# EAGLE schematic M7010X (EAGLE 6.6.0)
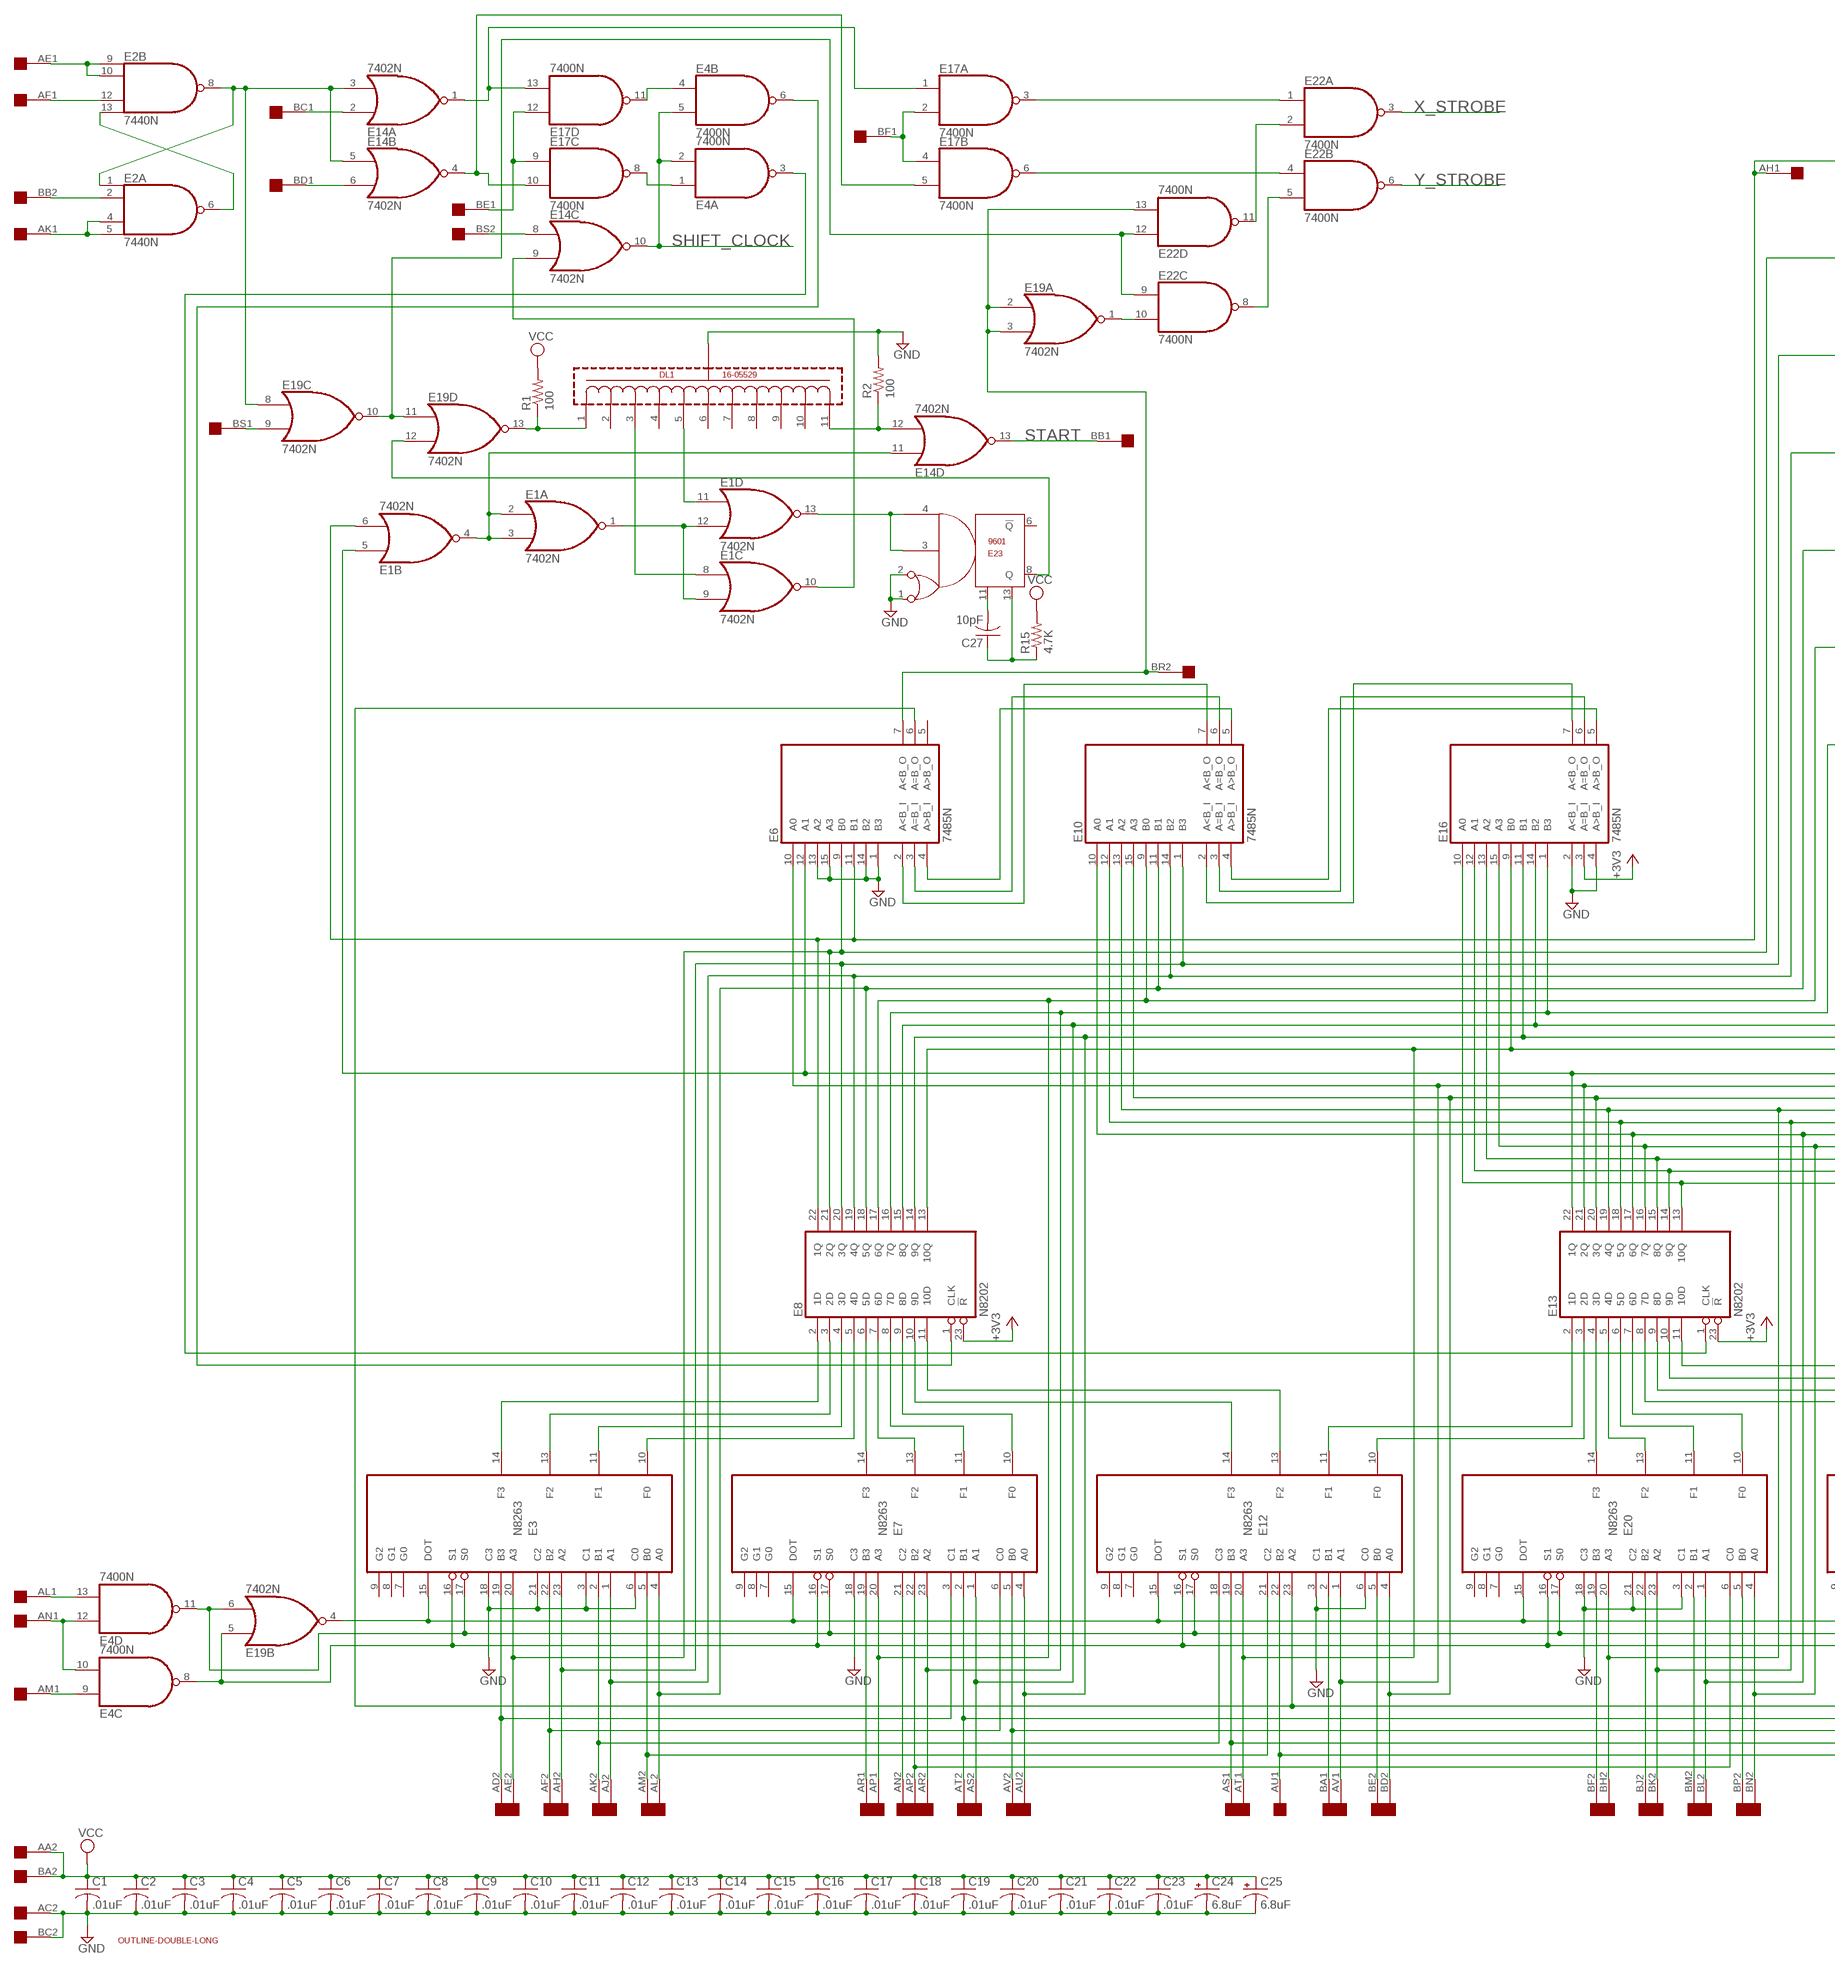
[diagram p0: schematic, sheet 1, part 1 of 2]
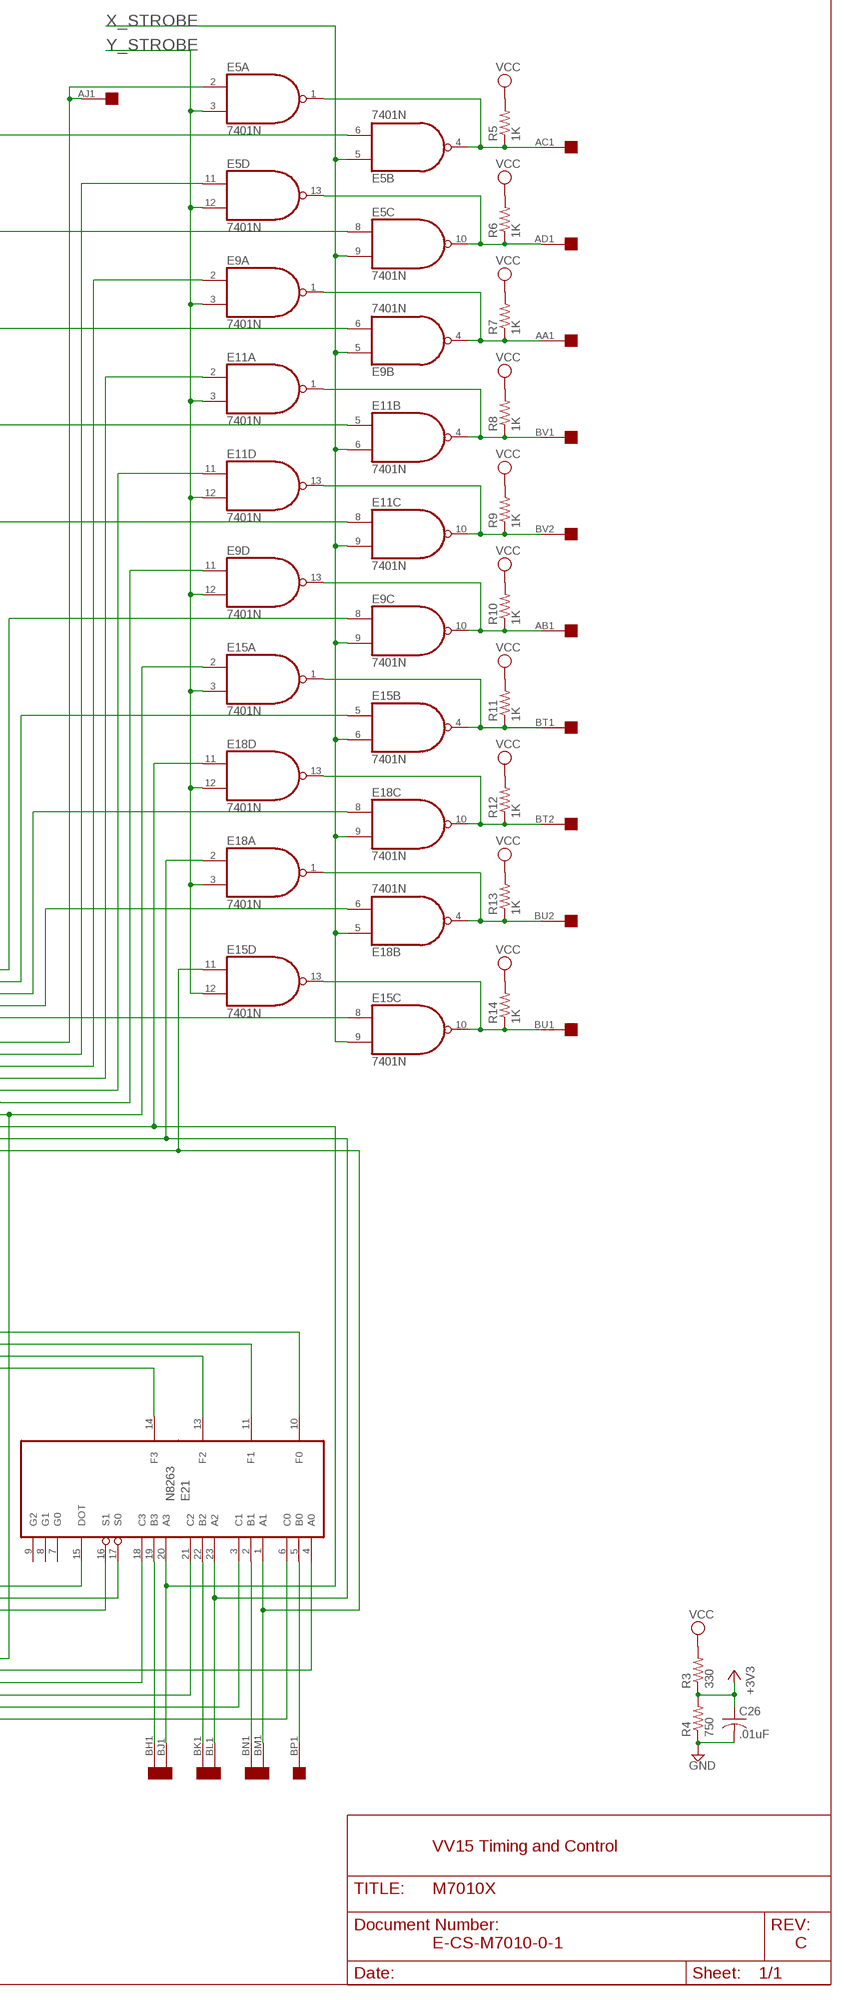
[diagram p1: schematic, sheet 1, part 2 of 2]

## Parts
C1  .01uF  C-US050-025X075  [C050-025X075]
C2  .01uF  C-US050-025X075  [C050-025X075]
C3  .01uF  C-US050-025X075  [C050-025X075]
C4  .01uF  C-US050-025X075  [C050-025X075]
C5  .01uF  C-US050-025X075  [C050-025X075]
C6  .01uF  C-US050-025X075  [C050-025X075]
C7  .01uF  C-US050-025X075  [C050-025X075]
C8  .01uF  C-US050-025X075  [C050-025X075]
C9  .01uF  C-US050-025X075  [C050-025X075]
C10  .01uF  C-US050-025X075  [C050-025X075]
C11  .01uF  C-US050-025X075  [C050-025X075]
C12  .01uF  C-US050-025X075  [C050-025X075]
C13  .01uF  C-US050-025X075  [C050-025X075]
C14  .01uF  C-US050-025X075  [C050-025X075]
C15  .01uF  C-US050-025X075  [C050-025X075]
C16  .01uF  C-US050-025X075  [C050-025X075]
C17  .01uF  C-US050-025X075  [C050-025X075]
C18  .01uF  C-US050-025X075  [C050-025X075]
C19  .01uF  C-US050-025X075  [C050-025X075]
C20  .01uF  C-US050-025X075  [C050-025X075]
C21  .01uF  C-US050-025X075  [C050-025X075]
C22  .01uF  C-US050-025X075  [C050-025X075]
C23  .01uF  C-US050-025X075  [C050-025X075]
C24  6.8uF  CPOL-USE20-8AXIAL  [E12-8]
C25  6.8uF  CPOL-USE20-8AXIAL  [E12-8]
C26  .01uF  C-US050-025X075  [C050-025X075]
C27  10pF  C-US050-025X075  [C050-025X075]
DL1  16-05529  [16-05529]
E1  7402N  [DIL14]
E2  7440N  7420N  [DIL14]
E3  N8263  [DIL24]
E4  7400N  [DIL14]
E5  7401N  74LS01N  [DIL14]
E6  7485N  [DIL16]
E7  N8263  [DIL24]
E8  N8202  [DIL24]
E9  7401N  74LS01N  [DIL14]
E10  7485N  [DIL16]
E11  7401N  74LS01N  [DIL14]
E12  N8263  [DIL24]
E13  N8202  [DIL24]
E14  7402N  [DIL14]
E15  7401N  74LS01N  [DIL14]
E16  7485N  [DIL16]
E17  7400N  [DIL14]
E18  7401N  74LS01N  [DIL14]
E19  7402N  [DIL14]
E20  N8263  [DIL24]
E21  N8263  [DIL24]
E22  7400N  [DIL14]
E23  9601  [DIL14]
R1  100  R-US_0207/10  [0207/10]
R2  100  R-US_0207/10  [0207/10]
R3  330  R-US_0207/10  [0207/10]
R4  750  R-US_0207/10  [0207/10]
R5  1K  R-US_0207/10  [0207/10]
R6  1K  R-US_0207/10  [0207/10]
R7  1K  R-US_0207/10  [0207/10]
R8  1K  R-US_0207/10  [0207/10]
R9  1K  R-US_0207/10  [0207/10]
R10  1K  R-US_0207/10  [0207/10]
R11  1K  R-US_0207/10  [0207/10]
R12  1K  R-US_0207/10  [0207/10]
R13  1K  R-US_0207/10  [0207/10]
R14  1K  R-US_0207/10  [0207/10]
R15  4.7K  R-US_0207/10  [0207/10]
U$1  OUTLINE-DOUBLE-LONG  [DOUBLE-LONG]
U$3  DOUBLE  [EDGE-CON4]

## Nets
+3V3: C26.1 E8.23(!R) E13.23(!R) E16.3(A=B_I) R3.1 R4.2
GND [supply]: C1.2 C2.2 C3.2 C4.2 C5.2 C6.2 C7.2 C8.2 C9.2 C10.2 C11.2 C12.2 C13.2 C14.2 C15.2 C16.2 C17.2 C18.2 C19.2 C20.2 C21.2 C22.2 C23.2 C24.- C25.- C26.2 DL1.12(GND) E3.3(C1) E3.6(C0) E3.18(C3) E3.21(C2) E6.1(B3) E6.13(A2) E6.14(B2) E6.15(A3) E7.18(C3) E12.3(C1) E12.6(C0) E16.2(A<B_I) E16.4(A>B_I) E20.3(C1) E20.18(C3) E20.21(C2) E23.1 E23.2 R2.2 R4.1 U$3.AC2 U$3.BC2
N$1: E3.20(A3) E5.8(C:I0) E6.9(B0) E8.21(2Q) U$3.AE2
N$2: E3.23(A2) E8.20(3Q) E9.6(B:I1) E10.1(B3) U$3.AH2
N$3: E3.1(A1) E8.19(4Q) E10.14(B2) E11.5(B:I0) U$3.AJ2
N$4: E3.4(A0) E8.18(5Q) E10.11(B1) E11.8(C:I0) U$3.AL2
N$5: E3.19(B3) E7.3(C1) U$3.AD2
N$6: E3.22(B2) E7.6(C0) U$3.AF2
N$7: E3.2(B1) E12.18(C3) U$3.AK2
N$8: E3.5(B0) E12.21(C2) U$3.AM2
N$9: E7.21(C2) U$3.AN2
N$10: E3.15(DOT) E7.15(DOT) E12.15(DOT) E19.4(B:O) E20.15(DOT) E21.15(DOT)
N$11: E3.17(S0) E4.11(D:O) E7.17(S0) E12.17(S0) E19.6(B:I1) E20.17(S0) E21.17(S0)
N$12: E3.16(S1) E4.8(C:O) E7.16(S1) E12.16(S1) E19.5(B:I0) E20.16(S1) E21.16(S1)
N$13: E7.5(B0) E21.21(C2) U$3.AV2
N$14: E7.2(B1) E21.18(C3) U$3.AT2
N$15: E7.22(B2) E20.6(C0) U$3.AP2
N$16: E7.20(A3) E8.17(6Q) E9.8(C:I0) E10.9(B0) U$3.AP1
N$17: E1.10(C:O) E14.9(C:I1)
N$18: E7.1(A1) E8.15(8Q) E16.14(B2) E18.8(C:I0) U$3.AS2
N$19: E7.23(A2) E8.16(7Q) E15.5(B:I0) E16.1(B3) U$3.AR2
N$20: E7.19(B3) U$3.AR1
N$21: E7.14(F3) E8.6(5D)
N$22: E7.13(F2) E8.7(6D)
N$23: E7.11(F1) E8.8(7D)
N$24: E7.10(F0) E8.9(8D)
N$25: E3.10(F0) E8.5(4D)
N$26: E3.11(F1) E8.4(3D)
N$27: E3.13(F2) E8.3(2D)
N$28: E3.14(F3) E8.2(1D)
N$29: E8.10(9D) E12.14(F3)
N$30: E8.11(10D) E12.13(F2)
N$31: E13.4(3D) E20.14(F3)
N$32: E13.5(4D) E20.13(F2)
N$33: E13.6(5D) E20.11(F1)
N$34: E13.7(6D) E20.10(F0)
N$35: E12.10(F0) E13.3(2D)
N$36: E12.11(F1) E13.2(1D)
N$37: E13.10(9D) E21.11(F1)
N$38: E13.8(7D) E21.14(F3)
N$39: E13.9(8D) E21.13(F2)
N$40: E13.11(10D) E21.10(F0)
N$41: E5.1(A:O) E5.4(B:O) R5.1 U$3.AC1
N$42: E5.10(C:O) E5.13(D:O) R6.1 U$3.AD1
N$43: E15.10(C:O) E15.13(D:O) R14.1 U$3.BU1
N$44: E18.1(A:O) E18.4(B:O) R13.1 U$3.BU2
N$45: E18.10(C:O) E18.13(D:O) R12.1 U$3.BT2
N$46: E15.1(A:O) E15.4(B:O) R11.1 U$3.BT1
N$47: E9.10(C:O) E9.13(D:O) R10.1 U$3.AB1
N$48: E9.1(A:O) E9.4(B:O) R7.1 U$3.AA1
N$49: E11.1(A:O) E11.4(B:O) R8.1 U$3.BV1
N$50: E11.10(C:O) E11.13(D:O) R9.1 U$3.BV2
N$51: E1.2(A:I0) E1.3(A:I1) E1.4(B:O) E14.11(D:I0)
N$52: DL1.11 E14.12(D:I1) R2.1
N$53: E2.1(A:I0) E2.8(B:O) E14.3(A:I1) E14.5(B:I0) E19.8(C:I0)
N$54: E1.5(B:I0) E5.2(A:I0) E6.12(A1) E13.22(1Q) U$3.AJ1
N$55: E1.6(B:I1) E5.6(B:I1) E6.11(B1) E8.22(1Q) U$3.AH1
N$56: E5.11(D:I0) E6.10(A0) E12.1(A1) E13.21(2Q) U$3.AV1
N$58: E9.2(A:I0) E10.15(A3) E12.4(A0) E13.20(3Q) U$3.BD2
N$60: E10.13(A2) E11.2(A:I0) E13.19(4Q) E20.20(A3) U$3.BH2
N$62: E10.12(A1) E11.11(D:I0) E13.18(5Q) E20.23(A2) U$3.BK2
N$63: E19.9(C:I1) U$3.BS1
N$64: E9.11(D:I0) E10.10(A0) E13.17(6Q) E20.1(A1) U$3.BL2
N$65: E8.13(10Q) E12.20(A3) E15.8(C:I0) E16.9(B0) U$3.AT1
N$66: E13.13(10Q) E15.11(D:I0) E16.10(A0) E21.1(A1) U$3.BM1
N$67: E7.4(A0) E8.14(9Q) E16.11(B1) E18.6(B:I1) U$3.AU2
N$68: E13.14(9Q) E16.12(A1) E18.2(A:I0) E21.23(A2) U$3.BL1
N$70: E13.15(8Q) E16.13(A2) E18.11(D:I0) E21.20(A3) U$3.BJ1
N$72: E13.16(7Q) E15.2(A:I0) E16.15(A3) E20.4(A0) U$3.BN2
N$73: E6.6(A=B_O) E12.23(A2) E21.4(A0)
N$74: E12.19(B3) E21.3(C1) U$3.AS1
N$76: E12.22(B2) E21.6(C0) U$3.AU1
N$77: E4.13(D:I1) U$3.AL1
N$78: E12.2(B1) U$3.BA1
N$80: E12.5(B0) U$3.BE2
N$82: E20.19(B3) U$3.BF2
N$84: E20.22(B2) U$3.BJ2
N$86: E20.2(B1) U$3.BM2
N$88: E20.5(B0) U$3.BP2
N$90: E21.19(B3) U$3.BH1
N$92: E21.22(B2) U$3.BK1
N$95: E21.2(B1) U$3.BN1
N$96: E21.5(B0) U$3.BP1
N$97: E4.9(C:I0) U$3.AM1
N$98: E10.4(A>B_I) E16.5(A>B_O)
N$99: E10.3(A=B_I) E16.6(A=B_O)
N$100: E10.2(A<B_I) E16.7(A<B_O)
N$101: E6.4(A>B_I) E10.5(A>B_O)
N$102: E6.3(A=B_I) E10.6(A=B_O)
N$103: E6.2(A<B_I) E10.7(A<B_O)
N$104: E4.10(C:I1) E4.12(D:I0) U$3.AN1
N$105: E14.6(B:I1) U$3.BD1
N$106: E14.2(A:I0) U$3.BC1
N$107: E14.4(B:O) E17.5(B:I1) E17.10(C:I1)
N$108: E2.9(B:I0) E2.10(B:I1) U$3.AE1
N$109: E2.12(B:I2) U$3.AF1
N$110: E2.6(A:O) E2.13(B:I3)
N$112: E2.2(A:I1) U$3.BB2
N$113: E2.4(A:I2) E2.5(A:I3) U$3.AK1
N$114: E14.1(A:O) E17.1(A:I0) E17.13(D:I1)
N$115: E17.9(C:I0) E17.12(D:I0) U$3.BE1
N$116: E4.1(A:I0) E17.8(C:O)
N$117: E4.4(B:I0) E17.11(D:O)
N$118: E14.8(C:I0) U$3.BS2
N$120: E19.10(C:O) E19.11(D:I0) E22.9(C:I0) E22.12(D:I0)
N$121: DL1.3 E1.8(C:I0)
N$122: DL1.1 E19.13(D:O) R1.1
N$123: DL1.5 E1.11(D:I0)
N$125: E1.1(A:O) E1.9(C:I1) E1.12(D:I1)
N$129: C27.2 E23.11
N$131: E1.13(D:O) E23.3 E23.4
N$132: E19.12(D:I1) E23.8(Q)
N$133: C27.1 E23.13 R15.1
N$134: E19.1(A:O) E22.10(C:I1)
N$140: E17.3(A:O) E22.1(A:I0)
N$141: E17.6(B:O) E22.4(B:I0)
N$142: E22.2(A:I1) E22.11(D:O)
N$143: E4.3(A:O) E13.1(CLK)
N$144: E4.6(B:O) E8.1(CLK)
N$145: E22.5(B:I1) E22.8(C:O)
N$148: E17.2(A:I1) E17.4(B:I0) U$3.BF1
N$149: E6.7(A<B_O) E19.2(A:I0) E19.3(A:I1) E22.13(D:I1) U$3.BR2
SHIFT_CLOCK: E4.2(A:I1) E4.5(B:I1) E14.10(C:O)
START: E14.13(D:O) U$3.BB1
VCC [supply]: C1.1 C2.1 C3.1 C4.1 C5.1 C6.1 C7.1 C8.1 C9.1 C10.1 C11.1 C12.1 C13.1 C14.1 C15.1 C16.1 C17.1 C18.1 C19.1 C20.1 C21.1 C22.1 C23.1 C24.+ C25.+ R1.2 R3.2 R5.2 R6.2 R7.2 R8.2 R9.2 R10.2 R11.2 R12.2 R13.2 R14.2 R15.2 U$3.AA2 U$3.BA2
X_STROBE: E5.5(B:I0) E5.9(C:I1) E9.5(B:I0) E9.9(C:I1) E11.6(B:I1) E11.9(C:I1) E15.6(B:I1) E15.9(C:I1) E18.5(B:I0) E18.9(C:I1) E22.3(A:O)
Y_STROBE: E5.3(A:I1) E5.12(D:I1) E9.3(A:I1) E9.12(D:I1) E11.3(A:I1) E11.12(D:I1) E15.3(A:I1) E15.12(D:I1) E18.3(A:I1) E18.12(D:I1) E22.6(B:O)
Unconnected: DL1.2 DL1.4 DL1.6 DL1.7 DL1.8 DL1.9 DL1.10 E2.3(3:NC) E2.11(11:NC) E3.7(G0) E3.8(G1) E3.9(G2) E6.5(A>B_O) E7.7(G0) E7.8(G1) E7.9(G2) E12.7(G0) E12.8(G1) E12.9(G2) E20.7(G0) E20.8(G1) E20.9(G2) E21.7(G0) E21.8(G1) E21.9(G2) E23.6(!Q) U$3.AB2 U$3.BR1

## Notes on the sheet
- VV15 Timing and Control
- E-CS-M7010-0-1 | C

## Power pins joined to a net without a drawn wire
GND: E1.7(P:GND) E2.7(P:GND) E3.12(GND) E4.7(P:GND) E5.7(P:GND) E6.8(GND) E7.12(GND) E8.12(GND) E9.7(P:GND) E10.8(GND) E11.7(P:GND) E12.12(GND) E13.12(GND) E14.7(P:GND) E15.7(P:GND) E16.8(GND) E17.7(P:GND) E18.7(P:GND) E19.7(P:GND) E20.12(GND) E21.12(GND) E22.7(P:GND) E23.7(GND)
VCC: E1.14(P:VCC) E2.14(P:VCC) E3.24(VCC) E4.14(P:VCC) E5.14(P:VCC) E6.16(VCC) E7.24(VCC) E8.24(VCC) E9.14(P:VCC) E10.16(VCC) E11.14(P:VCC) E12.24(VCC) E13.24(VCC) E14.14(P:VCC) E15.14(P:VCC) E16.16(VCC) E17.14(P:VCC) E18.14(P:VCC) E19.14(P:VCC) E20.24(VCC) E21.24(VCC) E22.14(P:VCC) E23.14(VCC)

## Library data of the parts
C1-C23 C26 C27 = rcl:C-US: CAPACITOR, American symbol
C24 C25 = dec-con:CPOL-USE20-8AXIAL: A 0.8 inch electrolytic.
DL1 = dec-con:16-05529: Delay Line (M311 style)
E1 E14 E19 = 74xx-us:74*02: Quad 2-input NOR gate
E2 = dec-con:74*20: Dual 4-input NAND gate
E3 E7 E12 E20 E21 = dec-con:N8263: 4 3-1 Multiplexers, XOR with DOT input
E4 E17 E22 = 74xx-us:74*00: Quad 2-input NAND gate
E5 E9 E11 E15 E18 = 74xx-us:74*01: Quad 2-input NAND gate, open collector
E6 E10 E16 = 74xx-us:74*85: 4-bit magnitude COMPARATOR
E8 E13 = dec-con:N8202: 10 bit register
E23 = dec-con:9601: DEC9601 monstable
R1-R15 = rcl:R-US_: RESISTOR, American symbol
U$1 = dec-con:OUTLINE-*: Board outlines for DEC boards.
U$3 = dec-con:DOUBLE: Double-Height DEC board

## Net classes
1 supply: width 0.813 mm